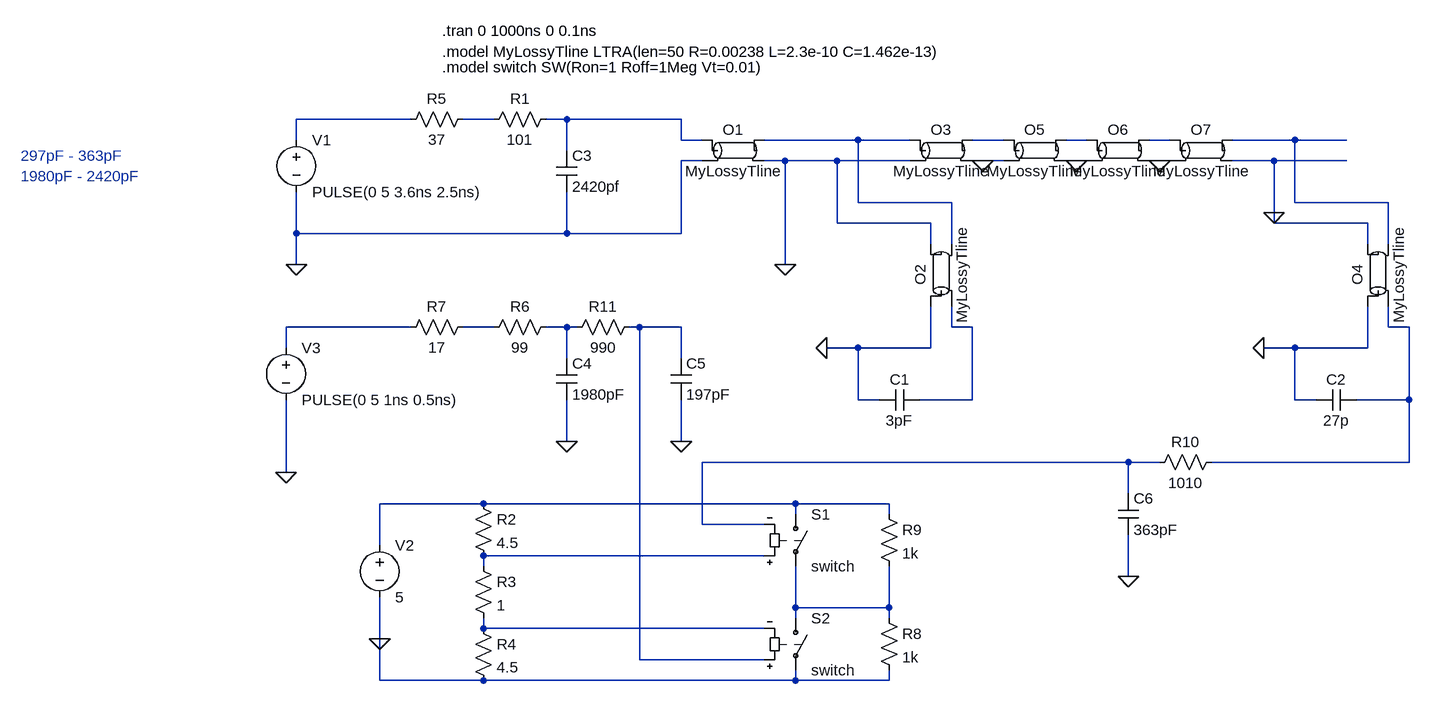
[diagram p0: schematic tline.asc]
tline.asc, the LTspice schematic file:
Version 4
SHEET 1 1756 760
WIRE -352 -112 -528 -112
WIRE -224 -112 -272 -112
WIRE -112 -112 -144 -112
WIRE 64 -112 -112 -112
WIRE -528 -80 -528 -112
WIRE 64 -80 64 -112
WIRE 96 -80 64 -80
WIRE 336 -80 192 -80
WIRE 416 -80 336 -80
WIRE 560 -80 512 -80
WIRE 688 -80 656 -80
WIRE 816 -80 784 -80
WIRE 1008 -80 912 -80
WIRE 1088 -80 1008 -80
WIRE -112 -64 -112 -112
WIRE 96 -48 64 -48
WIRE 224 -48 192 -48
WIRE 304 -48 224 -48
WIRE 416 -48 304 -48
WIRE 528 -48 512 -48
WIRE 560 -48 528 -48
WIRE 672 -48 656 -48
WIRE 688 -48 672 -48
WIRE 800 -48 784 -48
WIRE 816 -48 800 -48
WIRE 976 -48 912 -48
WIRE 1088 -48 976 -48
WIRE 336 16 336 -80
WIRE 480 16 336 16
WIRE 1008 16 1008 -80
WIRE 1152 16 1008 16
WIRE 976 32 976 -48
WIRE 304 48 304 -48
WIRE 448 48 304 48
WIRE 976 48 976 32
WIRE 1120 48 976 48
WIRE -528 64 -528 0
WIRE -112 64 -112 0
WIRE -112 64 -528 64
WIRE 64 64 64 -48
WIRE 64 64 -112 64
WIRE 448 80 448 48
WIRE 480 80 480 16
WIRE 1120 80 1120 48
WIRE 1152 80 1152 16
WIRE -528 112 -528 64
WIRE 224 112 224 -48
WIRE -352 208 -544 208
WIRE -224 208 -272 208
WIRE -112 208 -144 208
WIRE -96 208 -112 208
WIRE 0 208 -16 208
WIRE 64 208 0 208
WIRE 480 208 480 176
WIRE 512 208 480 208
WIRE 1152 208 1152 176
WIRE 1184 208 1152 208
WIRE -544 240 -544 208
WIRE 336 240 288 240
WIRE 448 240 448 176
WIRE 448 240 336 240
WIRE 1008 240 960 240
WIRE 1120 240 1120 176
WIRE 1120 240 1008 240
WIRE -112 256 -112 208
WIRE 64 256 64 208
WIRE 336 320 336 240
WIRE 368 320 336 320
WIRE 512 320 512 208
WIRE 512 320 432 320
WIRE 1008 320 1008 240
WIRE 1040 320 1008 320
WIRE 1184 320 1184 208
WIRE 1184 320 1104 320
WIRE -112 384 -112 320
WIRE 64 384 64 320
WIRE 752 416 96 416
WIRE 800 416 752 416
WIRE 1184 416 1184 320
WIRE 1184 416 880 416
WIRE -544 432 -544 320
WIRE 752 464 752 416
WIRE -240 480 -400 480
WIRE 240 480 -240 480
WIRE 384 480 240 480
WIRE 240 496 240 480
WIRE 384 496 384 480
WIRE 96 512 96 416
WIRE 192 512 96 512
WIRE -400 544 -400 480
WIRE 192 560 -240 560
WIRE -240 576 -240 560
WIRE 752 592 752 528
WIRE 240 640 240 576
WIRE 384 640 384 576
WIRE 384 640 240 640
WIRE 240 656 240 640
WIRE 384 656 384 640
WIRE -240 672 -240 656
WIRE 192 672 -240 672
WIRE -400 688 -400 624
WIRE 0 720 0 208
WIRE 192 720 0 720
WIRE -400 752 -400 688
WIRE -240 752 -400 752
WIRE 240 752 240 736
WIRE 240 752 -240 752
WIRE 384 752 384 736
WIRE 384 752 240 752
FLAG -528 112 0
FLAG 224 112 0
FLAG 288 240 0
FLAG 960 240 0
FLAG 976 32 0
FLAG 800 -48 0
FLAG 672 -48 0
FLAG 528 -48 0
FLAG -400 688 0
FLAG -112 384 0
FLAG -544 432 0
FLAG 64 384 0
FLAG 752 592 0
SYMBOL voltage -528 -96 R0
WINDOW 123 0 0 Left 2
WINDOW 39 24 124 Left 2
SYMATTR InstName V1
SYMATTR Value PULSE(0 5 3.6ns 2.5ns)
SYMBOL res -128 -128 R90
WINDOW 0 0 56 VBottom 2
WINDOW 3 32 56 VTop 2
SYMATTR InstName R1
SYMATTR Value 101
SYMBOL cap 432 304 R90
WINDOW 0 0 32 VBottom 2
WINDOW 3 32 32 VTop 2
SYMATTR InstName C1
SYMATTR Value 3pF
SYMATTR SpiceLine V=5 Irms=1 Rser=0.015 Lser=450p
SYMBOL ltline 144 -64 R0
SYMATTR InstName O1
SYMATTR Value MyLossyTline
SYMBOL ltline 464 128 R270
SYMATTR InstName O2
SYMATTR Value MyLossyTline
SYMBOL cap 1104 304 R90
WINDOW 0 0 32 VBottom 2
WINDOW 3 32 32 VTop 2
SYMATTR InstName C2
SYMATTR Value 27p
SYMATTR SpiceLine V=5 Irms=1 Rser=0.015 Lser=450p
SYMBOL ltline 1136 128 R270
SYMATTR InstName O4
SYMATTR Value MyLossyTline
SYMBOL ltline 608 -64 R0
SYMATTR InstName O5
SYMATTR Value MyLossyTline
SYMBOL ltline 736 -64 R0
SYMATTR InstName O6
SYMATTR Value MyLossyTline
SYMBOL ltline 864 -64 R0
SYMATTR InstName O7
SYMATTR Value MyLossyTline
SYMBOL ltline 464 -64 R0
SYMATTR InstName O3
SYMATTR Value MyLossyTline
SYMBOL cap -128 -64 R0
SYMATTR InstName C3
SYMATTR Value 2420pf
SYMBOL voltage -400 528 R0
WINDOW 123 0 0 Left 2
WINDOW 39 0 0 Left 2
SYMATTR InstName V2
SYMATTR Value 5
SYMBOL res -256 464 R0
SYMATTR InstName R2
SYMATTR Value 4.5
SYMBOL res -256 560 R0
SYMATTR InstName R3
SYMATTR Value 1
SYMBOL res -256 656 R0
SYMATTR InstName R4
SYMATTR Value 4.5
SYMBOL res -256 -128 R90
WINDOW 0 0 56 VBottom 2
WINDOW 3 32 56 VTop 2
SYMATTR InstName R5
SYMATTR Value 37
SYMBOL res -128 192 R90
WINDOW 0 0 56 VBottom 2
WINDOW 3 32 56 VTop 2
SYMATTR InstName R6
SYMATTR Value 99
SYMBOL cap -128 256 R0
SYMATTR InstName C4
SYMATTR Value 1980pF
SYMBOL res -256 192 R90
WINDOW 0 0 56 VBottom 2
WINDOW 3 32 56 VTop 2
SYMATTR InstName R7
SYMATTR Value 17
SYMBOL sw 240 480 R0
SYMATTR InstName S1
SYMATTR Value switch
SYMBOL sw 240 640 R0
SYMATTR InstName S2
SYMATTR Value switch
SYMBOL res 368 640 R0
SYMATTR InstName R8
SYMATTR Value 1k
SYMBOL res 368 480 R0
SYMATTR InstName R9
SYMATTR Value 1k
SYMBOL voltage -544 224 R0
WINDOW 123 0 0 Left 2
WINDOW 39 24 124 Left 2
SYMATTR InstName V3
SYMATTR Value PULSE(0 5 1ns 0.5ns)
SYMBOL res 896 400 R90
WINDOW 0 0 56 VBottom 2
WINDOW 3 32 56 VTop 2
SYMATTR InstName R10
SYMATTR Value 1010
SYMBOL res 0 192 R90
WINDOW 0 0 56 VBottom 2
WINDOW 3 32 56 VTop 2
SYMATTR InstName R11
SYMATTR Value 990
SYMBOL cap 48 256 R0
SYMATTR InstName C5
SYMATTR Value 197pF
SYMBOL cap 736 464 R0
SYMATTR InstName C6
SYMATTR Value 363pF
TEXT -304 -248 Left 2 !.tran 0 1000ns 0 0.1ns
TEXT -304 -216 Left 2 !.model MyLossyTline LTRA(len=50 R=0.00238 L=2.3e-10 C=1.462e-13)
TEXT -304 -192 Left 2 !.model switch SW(Ron=1 Roff=1Meg Vt=0.01)
TEXT -952 -56 Left 2 ;297pF - 363pF\n1980pF - 2420pF

The netlist it stands for:
* tline.asc
V1 N001 0 PULSE(0 5 3.6ns 2.5ns)
R1 N003 N002 101
C1 N013 0 3pF V=5 Irms=1 Rser=0.015 Lser=450p
O1 N003 0 N004 0 MyLossyTline
O2 0 N013 0 N004 MyLossyTline
C2 N014 0 27p V=5 Irms=1 Rser=0.015 Lser=450p
O4 0 N014 0 N008 MyLossyTline
O5 N005 0 N006 0 MyLossyTline
O6 N006 0 N007 0 MyLossyTline
O7 N007 0 N008 0 MyLossyTline
O3 N004 0 N005 0 MyLossyTline
C3 N003 0 2420pf
V2 N016 0 5
R2 N016 N017 4.5
R3 N017 N019 1
R4 N019 0 4.5
R5 N002 N001 37
R6 N011 N010 99
C4 N011 0 1980pF
R7 N010 N009 17
S1 N016 N018 N017 N015 switch
S2 N018 0 N012 N019 switch
R8 N018 0 1k
R9 N016 N018 1k
V3 N009 0 PULSE(0 5 1ns 0.5ns)
R10 N014 N015 1010
R11 N012 N011 990
C5 N012 0 197pF
C6 N015 0 363pF
.tran 0 1000ns 0 0.1ns
.model MyLossyTline LTRA(len=50 R=0.00238 L=2.3e-10 C=1.462e-13)
.model switch SW(Ron=1 Roff=1Meg Vt=0.01)
* 297pF - 363pF
* 1980pF - 2420pF
.backanno
.end